# EAGLE design LR2051-901-input-panel (EAGLE 9.7.0)
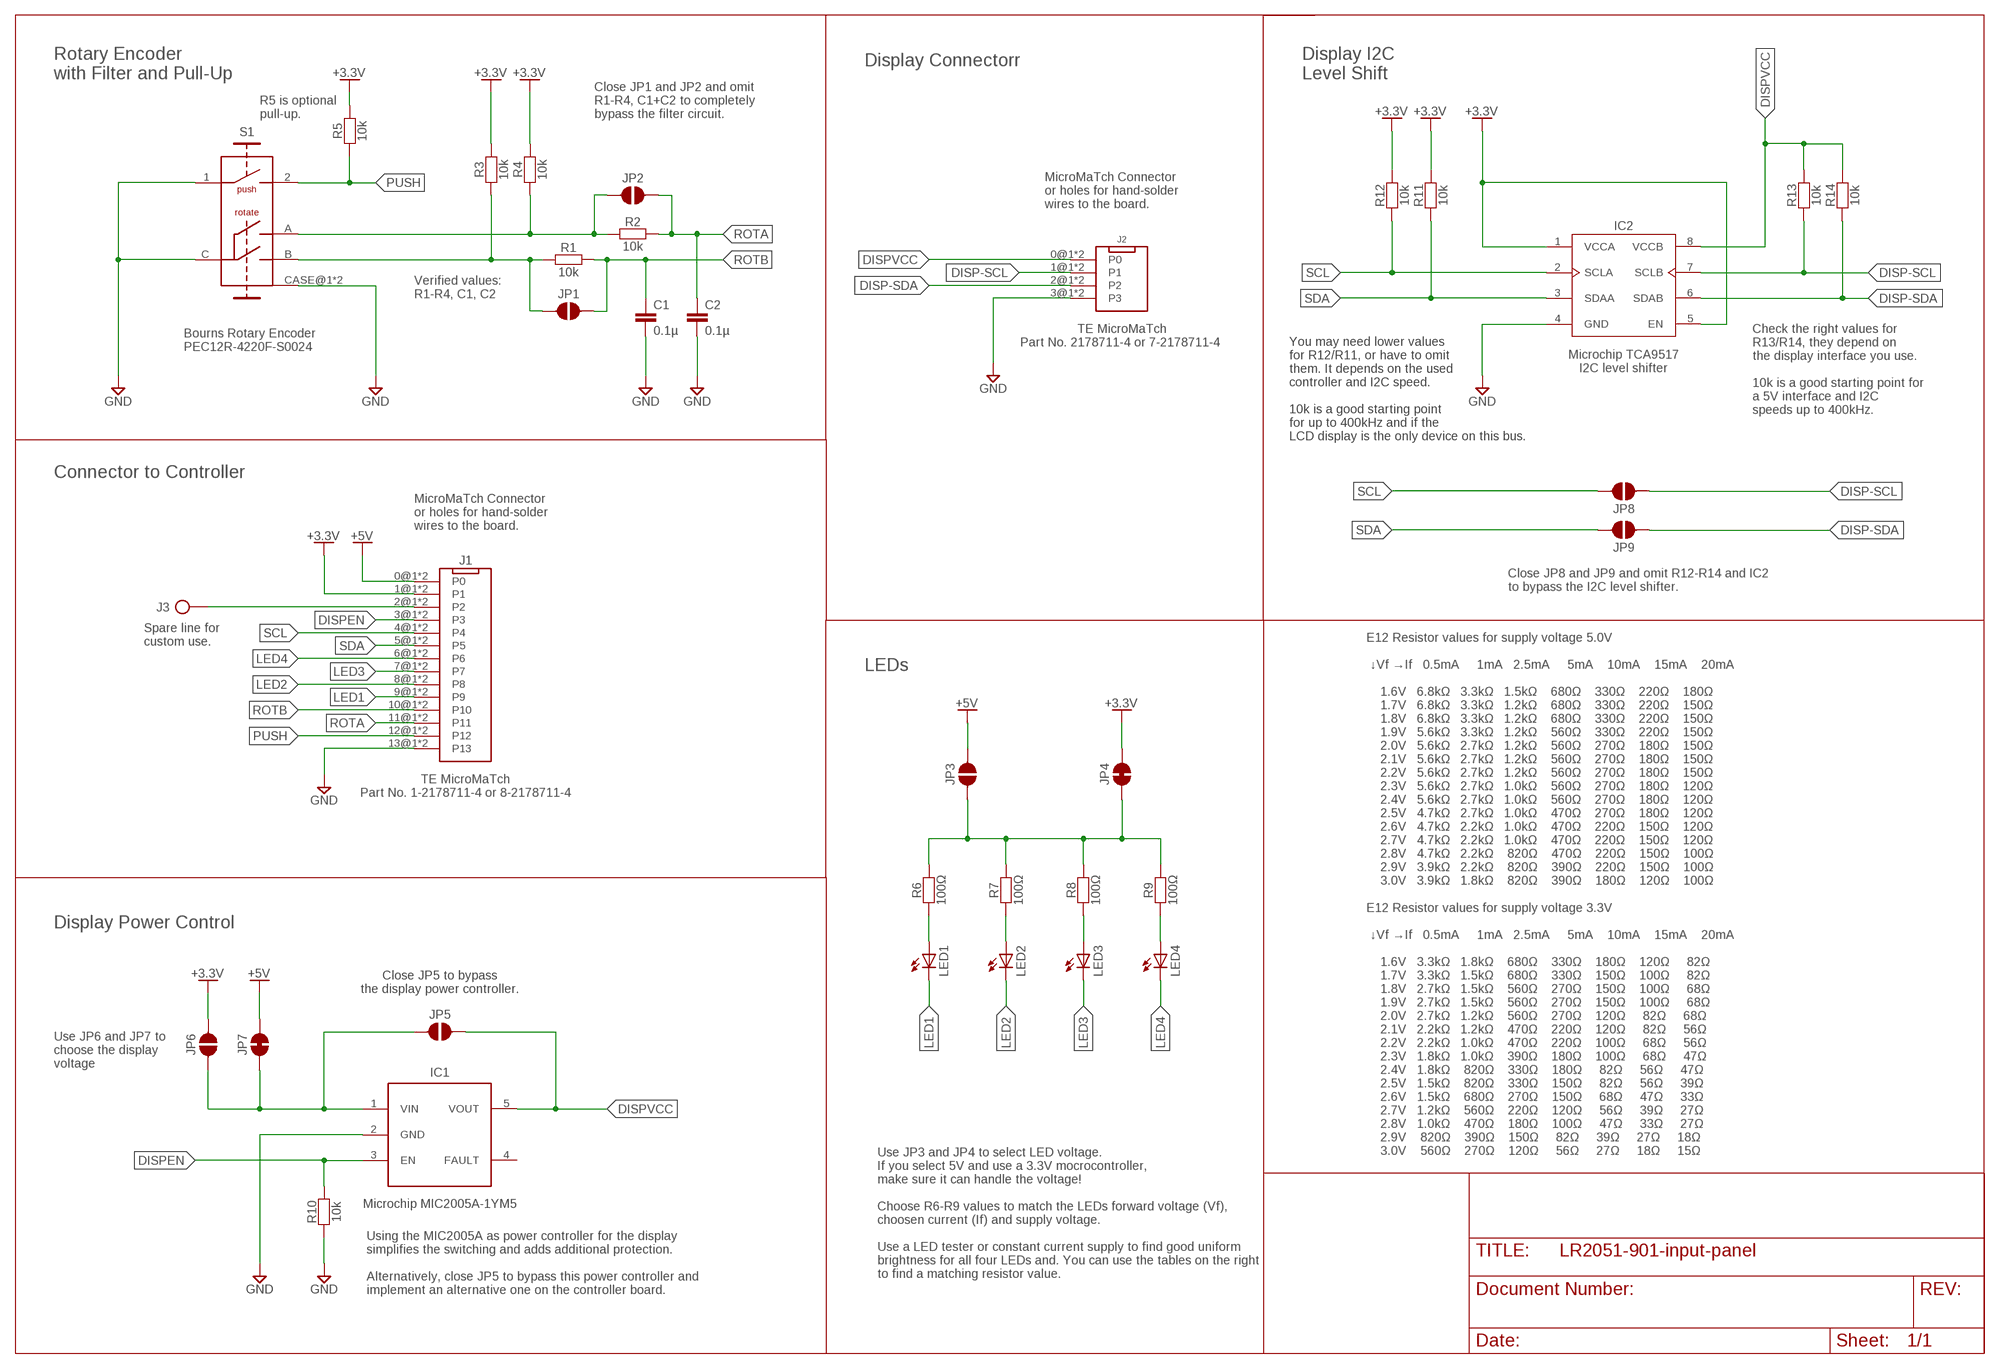
[diagram p0: schematic, sheet 1]

## Parts
C1  0.1µ  C0805-VISHAY  [CAPACITOR-0805-VISHAY]
C2  0.1µ  C0805-VISHAY  [CAPACITOR-0805-VISHAY]
IC1  IC-MIC2005A-1YM5  [SOT23-5]
IC2  IC-TCA9517  [SOIC127P599X175-8N]
J1  CON-TE-MICROMATCH-14P-SMD+TH  [CON-TE-MICROMATCH-1-2178711-4+TH]
J2  CON-TE-MICROMATCH-4P-SMD+TH  [CON-TE-MICROMATCH-2178711-4+TH]
J3  CON-HOLE-D0.9  [CON-HOLE-D0.9]
JP1  J-SMD-OFF  [J-SMD-OFF]
JP2  J-SMD-OFF  [J-SMD-OFF]
JP3  J-SMD-OFF  [J-SMD-OFF]
JP4  J-SMD-ON  [J-SMD-ON]
JP5  J-SMD-OFF  [J-SMD-OFF]
JP6  J-SMD-OFF  [J-SMD-OFF]
JP7  J-SMD-ON  [J-SMD-ON]
JP8  J-SMD-OFF  [J-SMD-OFF]
JP9  J-SMD-OFF  [J-SMD-OFF]
LED1  LED5MM  [LED5MM]
LED2  LED5MM  [LED5MM]
LED3  LED5MM  [LED5MM]
LED4  LED5MM  [LED5MM]
R1  10k  R-0805-HANDSOLDER  [R-0805-HANDSOLDER]
R2  10k  R-0805-HANDSOLDER  [R-0805-HANDSOLDER]
R3  10k  R-0805-HANDSOLDER  [R-0805-HANDSOLDER]
R4  10k  R-0805-HANDSOLDER  [R-0805-HANDSOLDER]
R5  10k  R-0805-HANDSOLDER  [R-0805-HANDSOLDER]
R6  100Ω  R-0805-HANDSOLDER  [R-0805-HANDSOLDER]
R7  100Ω  R-0805-HANDSOLDER  [R-0805-HANDSOLDER]
R8  100Ω  R-0805-HANDSOLDER  [R-0805-HANDSOLDER]
R9  100Ω  R-0805-HANDSOLDER  [R-0805-HANDSOLDER]
R10  10k  R-0805-HANDSOLDER  [R-0805-HANDSOLDER]
R11  10k  R-0805-HANDSOLDER  [R-0805-HANDSOLDER]
R12  10k  R-0805-HANDSOLDER  [R-0805-HANDSOLDER]
R13  10k  R-0805-HANDSOLDER  [R-0805-HANDSOLDER]
R14  10k  R-0805-HANDSOLDER  [R-0805-HANDSOLDER]
S1  ENC-BOURNS-PEC12R-4220F-S0024  [ENC-BOURNS-PEC12R-4220F-S0024]

## Nets
+3.3V: IC2.1(VCCA) IC2.5(EN) J1.1@1(P1) J1.1@2(P1) JP4.2 JP6.2 R3.2 R4.2 R5.2 R11.2 R12.2
+5V: J1.0@1(P0) J1.0@2(P0) JP3.2 JP7.2
DISP-SCL: IC2.7(SCLB) J2.1@1(P1) J2.1@2(P1) JP8.1 R13.1
DISP-SDA: IC2.6(SDAB) J2.2@1(P2) J2.2@2(P2) JP9.1 R14.1
DISP-VIN: IC1.1(VIN) JP5.1 JP6.1 JP7.1
DISPEN: IC1.3(EN) J1.3@1(P3) J1.3@2(P3) R10.2
DISPVCC: IC1.5(VOUT) IC2.8(VCCB) J2.0@1(P0) J2.0@2(P0) JP5.2 R13.2 R14.2
GND: C1.2 C2.2 IC1.2(GND) IC2.4(GND) J1.13@1(P13) J1.13@2(P13) J2.3@1(P3) J2.3@2(P3) R10.1 S1.1(S) S1.C S1.CASE@1(GND) S1.CASE@2(GND)
LED1: J1.9@1(P9) J1.9@2(P9) LED1.K(C)
LED2: J1.8@1(P8) J1.8@2(P8) LED2.K(C)
LED3: J1.7@1(P7) J1.7@2(P7) LED3.K(C)
LED4: J1.6@1(P6) J1.6@2(P6) LED4.K(C)
LED-VCC: JP3.1 JP4.1 R6.2 R7.2 R8.2 R9.2
N$1: JP1.1 R1.1 R3.1 S1.B
N$2: J1.2@1(P2) J1.2@2(P2) J3.1
N$3: JP2.1 R2.1 R4.1 S1.A
N$4: LED1.A R6.1
N$5: LED2.A R7.1
N$14: LED3.A R8.1
N$15: LED4.A R9.1
PUSH: J1.12@1(P12) J1.12@2(P12) R5.1 S1.2(S)
ROTA: C2.1 J1.11@1(P11) J1.11@2(P11) JP2.2 R2.2
ROTB: C1.1 J1.10@1(P10) J1.10@2(P10) JP1.2 R1.2
SCL: IC2.2(SCLA) J1.4@1(P4) J1.4@2(P4) JP8.2 R12.1
SDA: IC2.3(SDAA) J1.5@1(P5) J1.5@2(P5) JP9.2 R11.1
Unconnected: IC1.4(FAULT)

## Notes on the sheet
- Display Connectorr
- Rotary Encoder
  with Filter and Pull-Up
- Display I2C
  Level Shift
- R5 is optional
  pull-up.
- Close JP1 and JP2 and omit
  R1-R4, C1+C2 to completely
  bypass the filter circuit.
- MicroMaTch Connector
  or holes for hand-solder
  wires to the board.
- Verified values:
  R1-R4, C1, C2
- TE MicroMaTch
  Part No. 2178711-4 or 7-2178711-4
- Check the right values for
  R13/R14, they depend on
  the display interface you use.
  
  10k is a good starting point for 
  a 5V interface and I2C
  speeds up to 400kHz.
- You may need lower values
  for R12/R11, or have to omit
  them. It depends on the used
  controller and I2C speed.
  
  10k is a good starting point
  for up to 400kHz and if the
  LCD display is the only device on this bus.
- Microchip TCA9517
  I2C level shifter
- Bourns Rotary Encoder
  PEC12R-4220F-S0024
- Connector to Controller
- MicroMaTch Connector
  or holes for hand-solder
  wires to the board.
- Close JP8 and JP9 and omit R12-R14 and IC2
  to bypass the I2C level shifter.
- E12 Resistor values for supply voltage 5.0V
  
   ↓Vf →If   0.5mA     1mA   2.5mA     5mA    10mA    15mA    20mA
  
      1.6V   6.8kΩ   3.3kΩ   1.5kΩ    680Ω    330Ω    220Ω    180Ω
      1.7V   6.8kΩ   3.3kΩ   1.2kΩ    680Ω    330Ω    220Ω    150Ω
      1.8V   6.8kΩ   3.3kΩ   1.2kΩ    680Ω    330Ω    220Ω    150Ω
      1.9V   5.6kΩ   3.3kΩ   1.2kΩ    560Ω    330Ω    220Ω    150Ω
      2.0V   5.6kΩ   2.7kΩ   1.2kΩ    560Ω    270Ω    180Ω    150Ω
      2.1V   5.6kΩ   2.7kΩ   1.2kΩ    560Ω    270Ω    180Ω    150Ω
      2.2V   5.6kΩ   2.7kΩ   1.2kΩ    560Ω    270Ω    180Ω    150Ω
      2.3V   5.6kΩ   2.7kΩ   1.0kΩ    560Ω    270Ω    180Ω    120Ω
      2.4V   5.6kΩ   2.7kΩ   1.0kΩ    560Ω    270Ω    180Ω    120Ω
      2.5V   4.7kΩ   2.7kΩ   1.0kΩ    470Ω    270Ω    180Ω    120Ω
      2.6V   4.7kΩ   2.2kΩ   1.0kΩ    470Ω    220Ω    150Ω    120Ω
      2.7V   4.7kΩ   2.2kΩ   1.0kΩ    470Ω    220Ω    150Ω    120Ω
      2.8V   4.7kΩ   2.2kΩ    820Ω    470Ω    220Ω    150Ω    100Ω
      2.9V   3.9kΩ   2.2kΩ    820Ω    390Ω    220Ω    150Ω    100Ω
      3.0V   3.9kΩ   1.8kΩ    820Ω    390Ω    180Ω    120Ω    100Ω
- Spare line for
  custom use.
- LEDs
- TE MicroMaTch
  Part No. 1-2178711-4 or 8-2178711-4
- E12 Resistor values for supply voltage 3.3V
  
   ↓Vf →If   0.5mA     1mA   2.5mA     5mA    10mA    15mA    20mA
  
      1.6V   3.3kΩ   1.8kΩ    680Ω    330Ω    180Ω    120Ω     82Ω
      1.7V   3.3kΩ   1.5kΩ    680Ω    330Ω    150Ω    100Ω     82Ω
      1.8V   2.7kΩ   1.5kΩ    560Ω    270Ω    150Ω    100Ω     68Ω
      1.9V   2.7kΩ   1.5kΩ    560Ω    270Ω    150Ω    100Ω     68Ω
      2.0V   2.7kΩ   1.2kΩ    560Ω    270Ω    120Ω     82Ω     68Ω
      2.1V   2.2kΩ   1.2kΩ    470Ω    220Ω    120Ω     82Ω     56Ω
      2.2V   2.2kΩ   1.0kΩ    470Ω    220Ω    100Ω     68Ω     56Ω
      2.3V   1.8kΩ   1.0kΩ    390Ω    180Ω    100Ω     68Ω     47Ω
      2.4V   1.8kΩ    820Ω    330Ω    180Ω     82Ω     56Ω     47Ω
      2.5V   1.5kΩ    820Ω    330Ω    150Ω     82Ω     56Ω     39Ω
      2.6V   1.5kΩ    680Ω    270Ω    150Ω     68Ω     47Ω     33Ω
      2.7V   1.2kΩ    560Ω    220Ω    120Ω     56Ω     39Ω     27Ω
      2.8V   1.0kΩ    470Ω    180Ω    100Ω     47Ω     33Ω     27Ω
      2.9V    820Ω    390Ω    150Ω     82Ω     39Ω     27Ω     18Ω
      3.0V    560Ω    270Ω    120Ω     56Ω     27Ω     18Ω     15Ω
- Display Power Control
- Close JP5 to bypass
  the display power controller.
- Use JP6 and JP7 to
  choose the display
  voltage
- Use JP3 and JP4 to select LED voltage.
  If you select 5V and use a 3.3V mocrocontroller,
  make sure it can handle the voltage\!
  
  Choose R6-R9 values to match the LEDs forward voltage (Vf),
  choosen current (If) and supply voltage.
  
  Use a LED tester or constant current supply to find good uniform
  brightness for all four LEDs and. You can use the tables on the right
  to find a matching resistor value.
- Microchip MIC2005A-1YM5
- Using the MIC2005A as power controller for the display
  simplifies the switching and adds additional protection.
  
  Alternatively, close JP5 to bypass this power controller and
  implement an alternative one on the controller board.

## Library data of the parts
C1 C2 = Lucky Resistor Fusion:C
IC1 = Lucky Resistor Fusion:IC-MIC2005A-1YM5
IC2 = Lucky Resistor Fusion:IC-TCA9517
J1 = Lucky Resistor Fusion:CON-TE-MICROMATCH-14P: TE MicroMaTch Connector with 14 positions
J2 = Lucky Resistor Fusion:CON-TE-MICROMATCH-4P: TE Micro MaTch connector with 4 positions
J3 = Lucky Resistor Fusion:CON-HOLE: A hole as solder point to attach a wire to the board
JP1-JP3 JP5 JP6 JP8 JP9 = Lucky Resistor Fusion:J-SMD-OFF
JP4 JP7 = Lucky Resistor Fusion:J-SMD-ON: A connected jumper
LED1-LED4 = Lucky Resistor Fusion:LED
R1-R14 = Lucky Resistor Fusion:R
S1 = Lucky Resistor Fusion:ENC-BOURNS-PEC12R: Encoder Burns EC12R-4215F-S0024

## Board
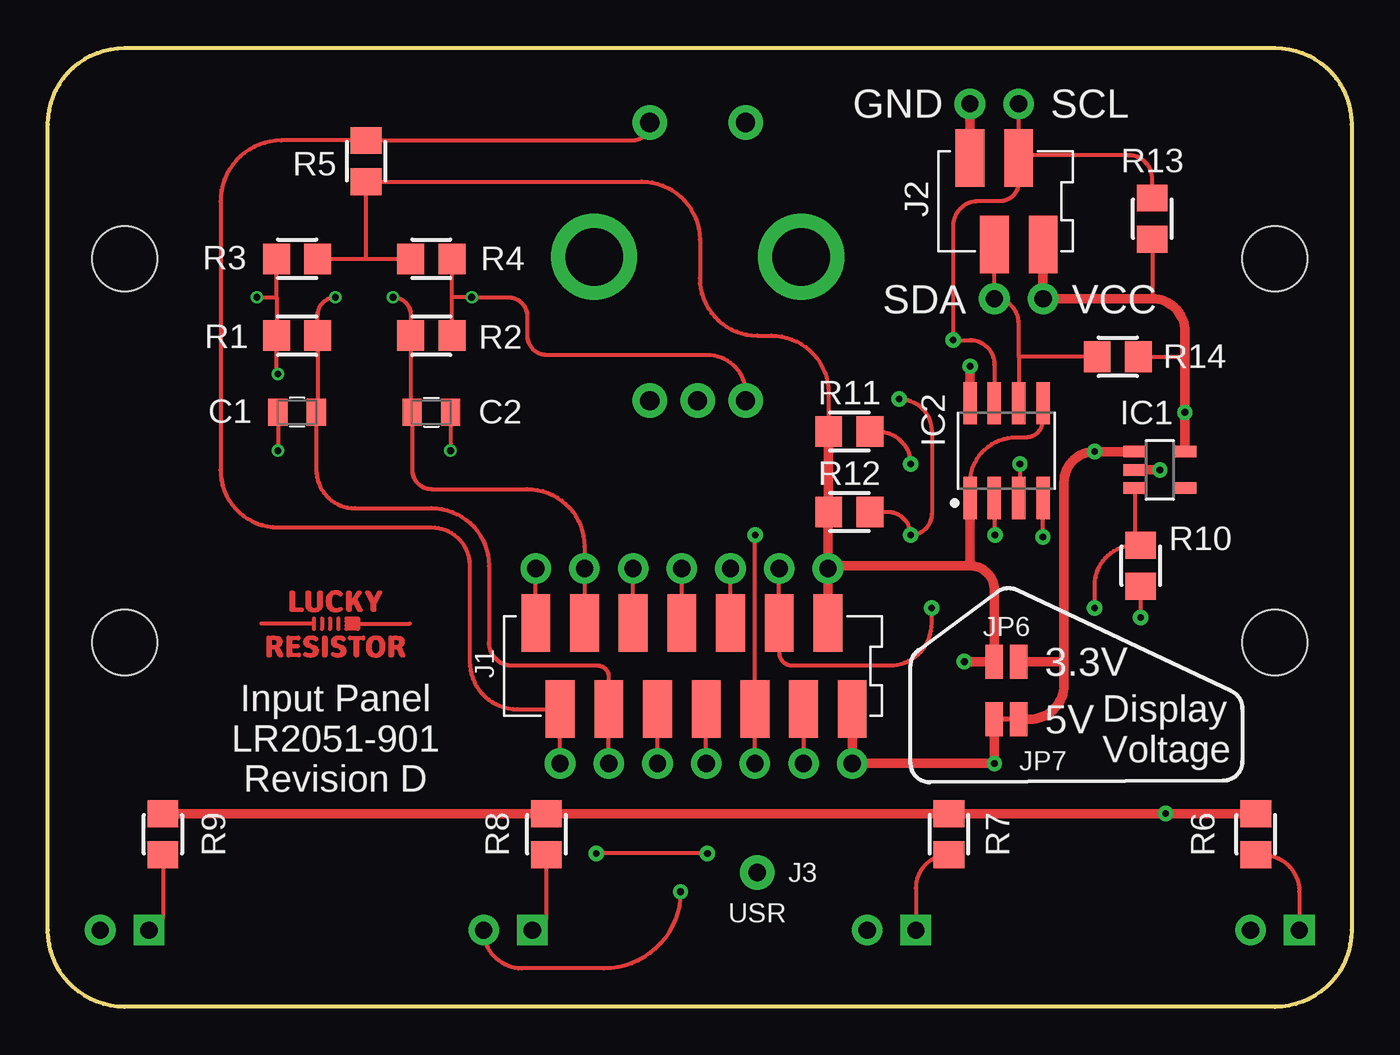
[diagram p1: board, top side]
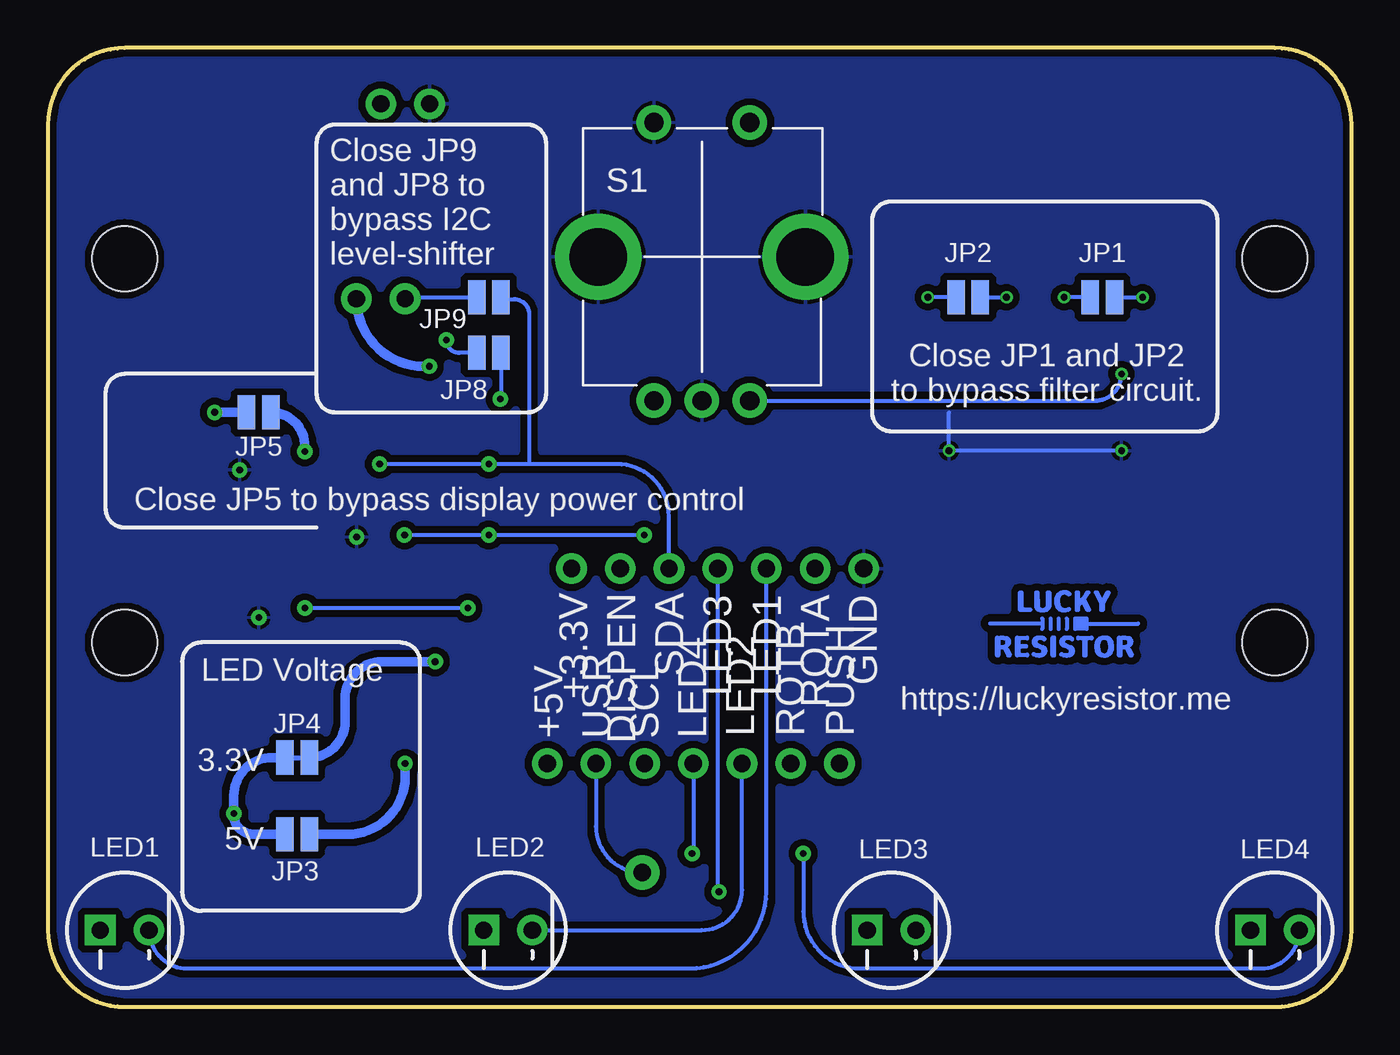
[diagram p2: board, bottom side, seen from below]

Size 68 x 50 mm. Coordinates in mm from the lower left corner, seen from the top.
Outline: 64,0 4,0 arc-90 0,4 0,46 arc-90 4,50 64,50 arc-90 68,46 68,4 arc-90 64,0
Copper layers (1*16): Top 0.018mm / dielectric 1.55mm / Bottom 0.018mm
Design rules "eC_2Layer_PClass6_BaseCopperO18_eCDefault *": minimum track width 0.15mm, minimum drill 0.35mm, track to track 0.15mm, track to pad 0.15mm, pad to pad 0.15mm, via to via 0.15mm, smd to smd 0mil, copper to edge 0.25mm, drill to drill 0.35mm, minimum pad ring 0.175mm, minimum via ring 0.15mm, stop-mask expansion 0mil, vias tented up to drill 0.45mm, thermal gap 0.2mm
Holes 3.4 mm at 4,39 64,39 4,19 64,19

### Footprints (pad centres in the part's own frame; a part is rotated, then mirrored left to right if it is on the bottom)
CAPACITOR-0805-VISHAY = smd 1 x 1.4: 1 -1,0; 2 1,0
SOT23-5 = smd 0.6 x 1.2: 1 -0.95,-1.306; 2 0,-1.306; 3 0.95,-1.306; 4 0.95,1.306; 5 -0.95,1.306
SOIC127P599X175-8N = smd 2.2 x 0.7: 1 -2.47,1.905; 2 -2.47,0.635; 3 -2.47,-0.635; 4 -2.47,-1.905; 5 2.47,-1.905; 6 2.47,-0.635; 7 2.47,0.635; 8 2.47,1.905
CON-TE-MICROMATCH-1-2178711-4+TH = smd 1.5 x 3: 0@1 8.255,-2.25; 1@1 6.985,2.25; 2@1 5.715,-2.25; 3@1 4.445,2.25; 4@1 3.175,-2.25; 5@1 1.905,2.25; 6@1 0.635,-2.25; 7@1 -0.635,2.25; 8@1 -1.905,-2.25; 9@1 -3.175,2.25; 10@1 -4.445,-2.25; 11@1 -5.715,2.25; 12@1 -6.985,-2.25; 13@1 -8.255,2.25 | drill 0.9 pad 1.6: 0@2 8.255,-5.08; 1@2 6.985,5.08; 2@2 5.715,-5.08; 3@2 4.445,5.08; 4@2 3.175,-5.08; 5@2 1.905,5.08; 6@2 0.635,-5.08; 7@2 -0.635,5.08; 8@2 -1.905,-5.08; 9@2 -3.175,5.08; 10@2 -4.445,-5.08; 11@2 -5.715,5.08; 12@2 -6.985,-5.08; 13@2 -8.255,5.08
CON-TE-MICROMATCH-2178711-4+TH = smd 1.5 x 3: 0@1 1.905,-2.25; 1@1 0.635,2.25; 2@1 -0.635,-2.25; 3@1 -1.905,2.25 | drill 0.9 pad 1.6: 0@2 1.905,-5.08; 1@2 0.635,5.08; 2@2 -0.635,-5.08; 3@2 -1.905,5.08
CON-HOLE-D0.9 = drill 0.9 pad 1.8: 1 0,0
J-SMD-OFF = smd 0.914 x 1.778: 1 -0.635,0; 2 0.635,0
J-SMD-ON = smd 0.914 x 1.778: 1 -0.635,0; 2 0.635,0
LED5MM = drill 0.9 pad 1.6 square: A -1.27,0 | drill 0.9 pad 1.6: K 1.27,0
R-0805-HANDSOLDER = smd 1.4 x 1.6: 1 -1.075,0; 2 1.075,0
ENC-BOURNS-PEC12R-4220F-S0024 = drill 1 pad 1.8: 1 -2.5,7; 2 2.5,7; A -2.5,-7.5; B 2.5,-7.5; C 0,-7.5 | drill 3: CASE@1 -5.4,0; CASE@2 5.4,0

### Placement (x,y rotation side)
C1  13,31 180 top
C2  20,31 0 top
IC1  58,28 270 top
IC2  50,29 90 top
J1  33.7,17.77 0 top
J2  50,42 0 top
J3  37,7 0 top
JP1  13,37 180 bottom
JP2  20,37 0 bottom
JP3  55,9 0 bottom
JP4  55,13 0 bottom
JP5  57,31 180 bottom
JP6  50,18 180 top
JP7  50,15 180 top
JP8  45,34.1 0 bottom
JP9  45,37 0 bottom
LED1  64,4 0 bottom
LED2  44,4 0 bottom
LED3  24,4 0 bottom
LED4  4,4 0 bottom
R1  13,35 0 top
R2  20,35 180 top
R3  13,39 0 top
R4  20,39 180 top
R5  16.6,44.1 270 top
R6  63,9 90 top
R7  47,9 90 top
R8  26,9 90 top
R9  6,9 90 top
R10  57,23 90 top
R11  41.8,30 180 top
R12  41.8,25.8 180 top
R13  57.6,41.1 270 top
R14  55.8,33.9 0 top
S1  33.89,39.11 0 bottom
U$1  [LR_LOGO_COPPER_8MM_NOMASK]  15,20 0 bottom
U$2  [LR_LOGO_COPPER_8MM_NOMASK]  15,20 0 top

### Tracks (layer width: path | path; a pad name or v marks a point on that pad's centre or on a via)
+3.3V  (via drill 0.35 pad 0.8)
  Top 0.2: IC2.1 48.09,27.3 arc-90 50.5,29.7 51.01,29.7 arc90 51.91,30.59 IC2.5 | 14,39 R3.2 16.6,39 | 16.6,39 R4.2 | 16.6,39 R5.2 30.98,43.02 arc-90 34,40 34,38 arc90 37,35 37.73,35 arc-90 40.73,32 R11.2
  Top 0.5: J1.1@2 J1.1@1 | J1.1@2 40.69,23 48.09,23 | 48.09,23 arc-90 49.37,21.73 JP6.2 v47.8,18 | IC2.1 48.09,23 | J1.1@2 40.69,25.8 R12.2 R11.2
  Bottom 0.5: v47.8,18 50.59,18 arc-90 52.5,16.09 52.5,14.87 arc90 JP4.2
+5V  (via drill 0.35 pad 0.8)
  Top 0.5: J1.0@1 J1.0@2 v49.37,12.69 JP7.2
  Bottom 0.5: JP3.2 52.37,9 arc-90 49.37,12 v49.37,12.69
DISP-SCL  (via drill 0.35 pad 0.8)
  Top 0.2: 50.63,44.4 J2.1@1 50.63,43 arc-90 49.64,42.01 48.52,42.01 arc90 47.21,40.7 v47.21,34.77 48.09,34.77 arc-90 49.37,33.5 IC2.7 | 50.63,44.4 J2.1@2 | R13.1 57.6,43.17 arc90 56.38,44.4 50.63,44.4
  Bottom 0.2: JP8.1 46.54,34.1 arc90 v47.21,34.77
DISP-SDA
  Top 0.2: J2.2@1 J2.2@2 arc-90 50.63,35.65 50.63,33.9 | 50.63,33.9 IC2.6 | R14.1 50.63,33.9
  Bottom 0.2: JP9.1 49.37,37 J2.2@2
DISP-VIN  (via drill 0.35 pad 0.8)
  Top 0.5: IC1.1 v54.6,28.95 arc90 53,27.35 53,18 | JP6.1 53,18 | JP7.1 51.21,15 arc90 53,16.79 53,18
  Bottom 0.5: JP5.1 arc90 54.6,29.23 v54.6,28.95
DISPEN  (via drill 0.35 pad 0.8)
  Top 0.2: J1.3@2 J1.3@1 38.15,18.46 arc90 38.81,17.8 43.9,17.8 arc90 46.1,20 v46.1,20.8 | IC1.3 56.69,24.07 | 56.69,24.07 R10.2 | v54.6,20.8 54.6,21.98 arc-90 56.69,24.07
  Bottom 0.2: v54.6,20.8 v46.1,20.8
DISPVCC  (via drill 0.35 pad 0.8)
  Top 0.2: R14.2 59.31,33.9 | R13.2 57.6,36.92
  Top 0.5: J2.0@1 J2.0@2 57.6,36.92 arc-90 59.31,35.22 59.31,33.9 v59.31,31 IC1.5 | IC2.8 v48.09,33.4 v48.1,33.4
  Bottom 0.5: JP5.2 v59.31,31 | v48.1,33.4 48.38,33.4 arc90 J2.0@2
GND  (via drill 0.35, 0.35 pad 0.8)
  Top 0.2: J1.13@1 J1.13@2 | IC2.4 v51.91,24.5 v51.9,24.5 | v57,20.3 R10.1 | C1.2 v12,29 | C2.2 v21,29
  Top 0.5: J2.3@2 J2.3@1 | v58,28 IC1.2
  Bottom 0.2: v12,29 v21,29 C2.2
  pour Bottom (isolate 0.35): 4,0 arc-90 0,4 0,46 arc-90 4,50 64,50 arc-90 68,46 68,4 arc-90 64,0
LED1
  Top 0.2: J1.9@1 J1.9@2
  Bottom 0.2: J1.9@2 30.52,6 arc90 34.52,2 60.73,2 arc90 LED1.K
LED2
  Top 0.2: J1.8@2 J1.8@1
  Bottom 0.2: LED2.K 33.9,4 arc-90 31.8,6.1 J1.8@2
LED3  (via drill 0.35 pad 0.8)
  Top 0.2: J1.7@1 J1.7@2 | v33,6 arc-90 29,2 24.73,2 arc-90 LED3.K
  Bottom 0.2: J1.7@2 33.06,6 v33,6
LED4  (via drill 0.35 pad 0.8)
  Top 0.2: J1.6@2 J1.6@1 | v34.4,8 v28.6,8
  Bottom 0.2: J1.6@2 34.34,8 v34.4,8 | v28.6,8 28.6,4.97 arc-90 25.63,2 4.73,2 arc-90 LED4.K
LED-VCC  (via drill 0.35 pad 0.8)
  Top 0.5: R9.2 R8.2 R7.2 v58.3,10.07 R6.2
  Bottom 0.5: JP3.1 57.3,9 arc90 58.3,10 v58.3,10.07 58.3,11 arc90 56.3,13 JP4.1
N$1  (via drill 0.35)
  Top 0.2: 11.93,37 R1.1 11.93,33 v12,33 | 11.93,37 R3.1 | v10.9,37 11.93,37
  Bottom 0.2: JP1.1 v10.9,37 | S1.B 13.39,31.61 arc-90 v12,33
N$2
  Top 0.2: J1.2@1 J1.2@2
  Bottom 0.2: J1.2@2 39.41,9.41 arc-90 J3.1
N$3  (via drill 0.35)
  Top 0.2: R2.1 21.07,37 | 21.07,37 R4.1 | 21.07,37 v22.1,37 24,37 arc-90 25,36 25,35 arc90 26,34 34.39,34 arc-90 36.39,32 S1.A
  Bottom 0.2: JP2.1 v22.1,37
N$4
  Top 0.2: R6.1 63.37,7.92 arc-90 65.27,6.02 LED1.A
N$5
  Top 0.2: R7.1 arc90 45.27,6.2 LED2.A
N$14
  Top 0.2: LED3.A arc90 26,4.73 R8.1
N$15
  Top 0.2: R9.1 6,4.73 arc-90 LED4.A
PUSH
  Top 0.2: J1.12@2 J1.12@1 24.48,15.52 arc-90 22,18 22,23 arc90 20,25 12,25 arc-90 9,28 9,42 arc-90 12.18,45.17 R5.1 30.45,45.17 arc90 S1.2
ROTA  (via drill 0.35)
  Top 0.2: J1.11@1 J1.11@2 27.98,24 arc90 24.98,27 20,27 arc-90 19,28 C2.1 18.93,31 R2.2 18.93,36.08 arc90 v18,37
  Bottom 0.2: JP2.2 v18,37
ROTB  (via drill 0.35)
  Top 0.2: J1.10@2 J1.10@1 29.25,17.2 arc90 28.66,17.8 24.2,17.8 arc-90 23,19 23,23 arc90 20,26 16,26 arc-90 14,28 C1.1 14.07,31 R1.2 14.07,36.08 arc-90 v15,37
  Bottom 0.2: JP1.2 v15,37
SCL  (via drill 0.35 pad 0.8)
  Top 0.2: J1.4@2 J1.4@1 36.88,24.6 v36.9,24.6 | v49.4,24.6 49.4,26.53 IC2.2 | R12.1 43.8,25.8 arc-90 v45,24.6 arc90 46.1,25.7 46.1,30 arc90 v44.4,31.7
  Bottom 0.2: v36.9,24.6 v45,24.6 v49.4,24.6 | JP8.2 44.37,31.7 v44.4,31.7
SDA  (via drill 0.35 pad 0.8)
  Top 0.2: J1.5@1 J1.5@2 | v50.7,28.3 50.7,26.53 IC2.3 | R11.1 43.3,30 arc-90 v45,28.3
  Bottom 0.2: J1.5@2 35.6,25.59 arc-90 38.31,28.3 42.9,28.3 | 42.9,28.3 v45,28.3 v50.7,28.3 | JP9.2 44.37,36.9 43.68,36.9 arc90 42.9,36.12 42.9,28.3

### Text on the board
tPlace: GND | SCL | SDA | VCC | 3.3V | 5V | Input Panel / LR2051-901 / Revision D | Display / Voltage | USR
bPlace: Close JP9 / and JP8 to / bypass I2C / level-shifter | Close JP1 and JP2 / to bypass filter circuit. | Close JP5 to bypass display power control | GND | ROTA | LED1 | LED3 | SDA | DISPEN | +3.3V | LED Voltage | https://luckyresistor.me | PUSH | ROTB | LED2 | LED4 | SCL | USR | +5V | 3.3V | 5V